# Altium schematic sheet Top.SchDoc
size B; DocumentNumber: 1; SheetNumber: 1; SheetTotal: 3
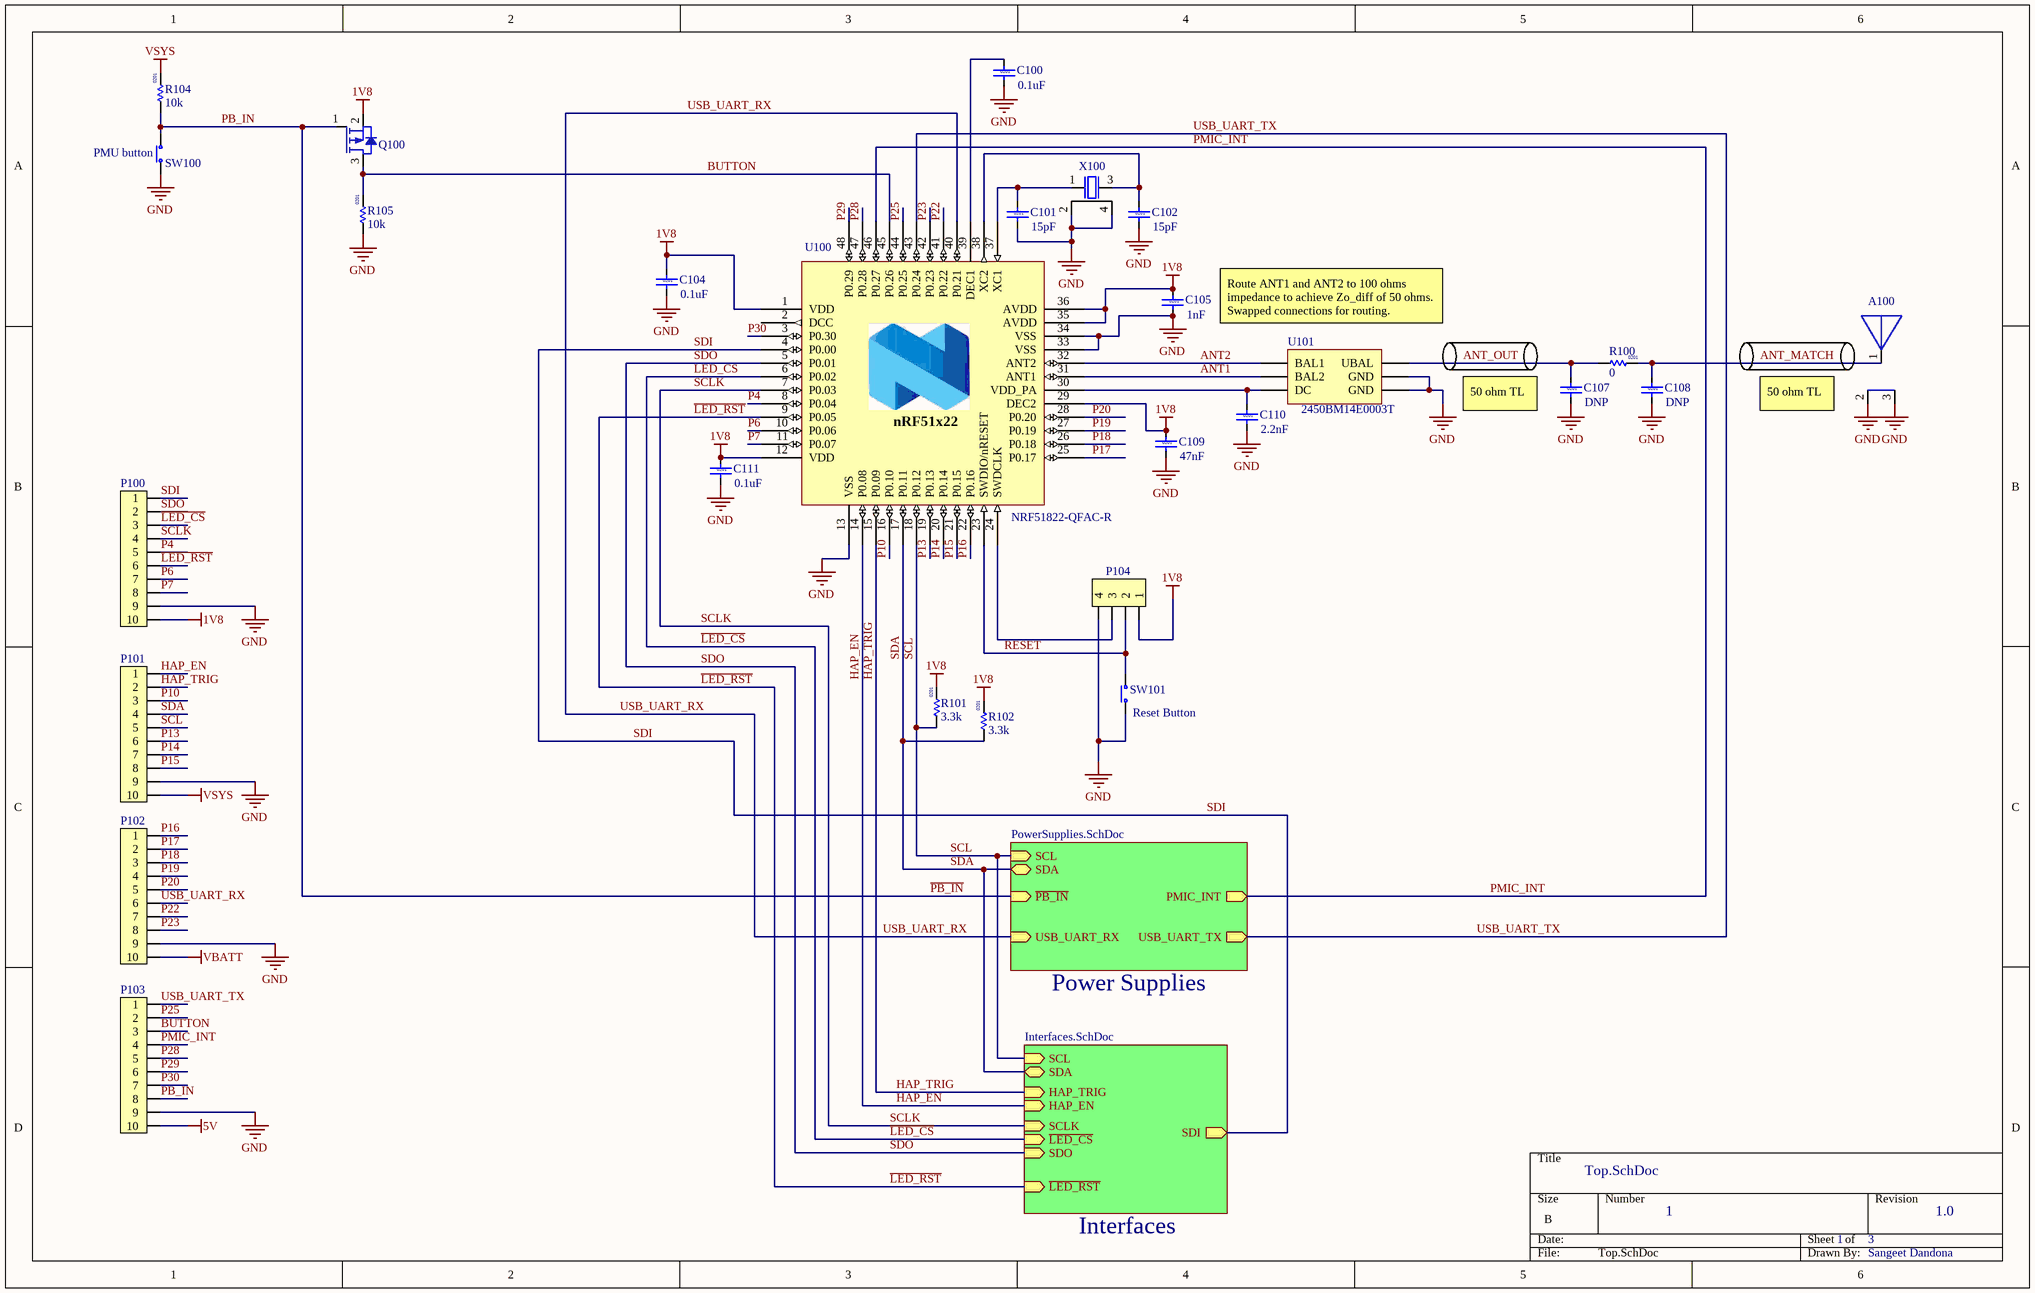
[diagram p0: Top.SchDoc]

## Parts
A100  (no value)  [2450AT07A0100]
C100  value 0.1uF  Size: 0201  [Cap 0201 HD]
C101  value 15pF  Size: 0201  [Cap 0201 HD]
C102  value 15pF  Size: 0201  [Cap 0201 HD]
C104  value 0.1uF  Size: 0201  [Cap 0201 HD]
C105  value 1nF  Size: 0201  [Cap 0201 HD]
C107  value DNP  Size: 0201  [Cap 0201 HD]
C108  value DNP  Size: 0201  [Cap 0201 HD]
C109  value 47nF  Size: 0201  [Cap 0201 HD]
C110  value 2.2nF  Size: 0201  [Cap 0201 HD]
C111  value 0.1uF  Size: 0201  [Cap 0201 HD]
P100  (no value)  [Molex 15-91-2100]
P101  (no value)  [Molex 15-91-2100]
P102  (no value)  [Molex 15-91-2100]
P103  (no value)  [Molex 15-91-2100]
P104  (no value)  [LIST_1x4_SMD]
Q100  (no value)  [SOT-723]
R100  value 0  Size: 0201  [RES 0201 HD]
R101  value 3.3k  Size: 0201  [RES 0201 HD]
R102  value 3.3k  Size: 0201  [RES 0201 HD]
R104  value 10k  Size: 0201  [RES 0201 HD]
R105  value 10k  Size: 0201  [RES 0201 HD]
SW100  (no value)  [ALPS_SKHUxxx010_WO_GND]
SW101  (no value)  [ALPS_SKHUxxx010_WO_GND]
U100  NRF51822-QFAC-R  [QFN40P600X600X90-48N]
U101  MFPN: 2450BM14E0003T  [2450BM14E0003]  (hidden comment: nRF51822 Balun RF filter)
X100  (no value)  [XTAL_ABM11-16]

## Sub-sheets
Interfaces = Interfaces.SchDoc: SDA (bidir), SCL (in), SDO (in), ~{LED_CS} (in), ~{LED_RST} (in), SCLK (in), HAP_EN (in), HAP_TRIG (in), SDI (out)
Power Supplies = PowerSupplies.SchDoc: SCL (in), SDA (bidir), PMIC_INT (out), ~{PB_IN} (in), USB_UART_RX (in), USB_UART_TX (out)

## Nets
1V8: C104.1 C105.1 C109.1 C111.1 P100.10 P104.1 Q100.2(S) R101.2 R102.2 U100.1(VDD) U100.12(VDD) U100.29(DEC2) U100.35(AVDD) U100.36(AVDD)
5V: P103.10
GND: A100.2 A100.3 C100.2 C101.2 C102.2 C104.2 C105.2 C107.2 C108.2 C109.2 C110.2 C111.2 P100.9 P101.9 P102.9 P103.9 P104.4 R105.1 SW100.2(COM) SW101.2(COM) U100.13(VSS) U100.33(VSS) U100.34(VSS) U100.49 U101.2(GND) U101.6(GND) X100.2 X100.4
VBATT: P102.10
VSYS: P101.10 R104.2
~{LED_CS}: P100.3 U100.6(P0.02) ; sheet Interfaces/~{LED_CS}
~{LED_RST}: P100.6 U100.9(P0.05) ; sheet Interfaces/~{LED_RST}
~{PB_IN}: P103.8 Q100.1(G) R104.1 SW100.1(N.O) ; sheet Power Supplies/~{PB_IN}  [also labelled PB_IN]
~{RESET}: P104.2 SW101.1(N.O) U100.23(SWDIO/nRESET)
ANT1: U100.31(ANT1) U101.4(BAL2)
ANT2: U100.32(ANT2) U101.3(BAL1)
ANT_MATCH: A100.1 C108.1 R100.2
ANT_OUT: C107.1 R100.1 U101.1(UBAL)
BUTTON: P103.3 Q100.3(D) R105.2 U100.45(P0.26)
HAP_EN: P101.1 U100.14(P0.08) ; sheet Interfaces/HAP_EN
HAP_TRIG: P101.2 U100.15(P0.09) ; sheet Interfaces/HAP_TRIG
P4: P100.5 U100.8(P0.04)
P6: P100.7 U100.10(P0.06)
P7: P100.8 U100.11(P0.07)
P10: P101.3 U100.16(P0.10)
P13: P101.6 U100.19(P0.13)
P14: P101.7 U100.20(P0.14)
P15: P101.8 U100.21(P0.15)
P16: P102.1 U100.22(P0.16)
P17: P102.2 U100.25(P0.17)
P18: P102.3 U100.26(P0.18)
P19: P102.4 U100.27(P0.19)
P20: P102.5 U100.28(P0.20)
P22: P102.7 U100.41(P0.22)
P23: P102.8 U100.42(P0.23)
P25: P103.2 U100.44(P0.25)
P28: P103.5 U100.47(P0.28)
P29: P103.6 U100.48(P0.29)
P30: P103.7 U100.3(P0.30)
PMIC_INT: P103.4 U100.46(P0.27) ; sheet Power Supplies/PMIC_INT
SCL: P101.5 R101.1 U100.18(P0.12) ; sheet Interfaces/SCL, sheet Power Supplies/SCL
SCLK: P100.4 U100.7(P0.03) ; sheet Interfaces/SCLK
SDA: P101.4 R102.1 U100.17(P0.11) ; sheet Interfaces/SDA, sheet Power Supplies/SDA
SDI: P100.1 U100.4(P0.00) ; sheet Interfaces/SDI
SDO: P100.2 U100.5(P0.01) ; sheet Interfaces/SDO
USB_UART_RX: P102.6 U100.40(P0.21) ; sheet Power Supplies/USB_UART_RX
USB_UART_TX: P103.1 U100.43(P0.24) ; sheet Power Supplies/USB_UART_TX
NetC100_1: C100.1 U100.39(DEC1)
NetC101_1: C101.1 U100.37(XC1) X100.1
NetC102_1: C102.1 U100.38(XC2) X100.3
NetC110_1: C110.1 U100.30(VDD_PA) U101.5(DC)
NetP104_3: P104.3 U100.24(SWDCLK)

Not connected (* = marked no-connect by the designer): U100 2(DCC)

## Notes on the sheet
- (near SW100) PMU button
- Route ANT1 and ANT2 to 100 ohms impedance to achieve Zo_diff of 50 ohms. Swapped connections for routing.
- (near C107) 50 ohm TL
- (near A100) 50 ohm TL
- (near SW101) Reset Button
- 1.0
- Sangeet Dandona
- (in symbol nRF51x22_QFAx) nRF51x22

## Library data of the parts
A100 = 2450AT07A0100: ANTENNA SMD EIA 0402 2.4GHZ; MF: Johanson Technology Inc.; MFPN: 2450AT07A0100E; Size: 1mmx0.5mm; Height: 0.37mm; Cost: 0.36562
C100 C104 C111 = Cap 0201 0.1uF 6.3V: CAP CER 0.1UF 6.3V 10% X5R 0201; MF: Murata Electronics North America; MFPN: GRM033R60J104KE19D; Cost: 0.00780
C101 C102 = Cap 0201 11pF 25V: CAP CER 15PF 25V NP0 0201; MF: Murata Electronics North America; MFPN: GRM0335C1E150FA01D; Cost: 0.00900
C105 = Cap 0201 1nF 25V: CAP CER 1000PF 25V 10% X7R 0201; MF: Murata Electronics North America; MFPN: GRM033R71E102KA01D; Cost: 0.00600
C107 C108 = Cap 0201 Generic: Capacitor, Ceramic 0201, DNP; Cost: 0; MF: N/A; MFPN: DNP
C109 = Cap 0201 47nF 10V: CAP CER 0.047UF 10V 10% X5R 0201; MF: Taiyo Yuden; MFPN: LMK063BJ473KP-F; Cost: 0.03000
C110 = Cap 0201 2.2nF 16V: CAP CER 2200PF 16V 10% X7R 0201; MF: Murata Electronics North America; MFPN: GRM033R71C222KA88D; Cost: 0.00630
P100-P103 = CONN-10: CONN HEADER 10POS .100" VERT TIN; MF: Molex, LLC; MFPN: 0015912100; Cost: 0.47152
P104 = CONN-4: BOARD-BOARD CONNECTOR HEADER, 4WAY, 1ROW; MF: GLOBAL CONNECTOR TECHNOLOGY; MFPN: BG055-04A-1-0450-0530-0350-L-G; Cost: 0.213
Q100 = MOSFET-P: MOSFET P-CH 20V 0.1A VMT3; MF: Rohm Semiconductor; MFPN: RZM001P02T2L; Size: 1.2mm x 0.8mm; Package: SOT-723; Cost: 0.22000; Type: MOSFET-P
R100 = Res 0201 0R Jumper: RES SMD 0.0OHM JUMPER 1/20W 0201; MF: Samsung Electro-Mechanics America, Inc.; MFPN: RC0603J000CS; Cost: 0.00787
R101 R102 = Res 0201 3.3k 5%: RES SMD 3.3K OHM 5% 1/20W 0201; MF: Samsung Electro-Mechanics America, Inc.; MFPN: RC0603J332CS; Cost: 0.00648
R104 R105 = Res 0201 10k 5%: RES SMD 10K OHM 5% 1/20W 0201; MF: Rohm Semiconductor; MFPN: MCR006YRTJ103; Cost: 0.00828
SW100 SW101 = SW-PB: Tactile Switches 6.0x6.0x2.5mm 160gf; MF: ALPS; MFPN: SKHUALE010; Cost: 0.201; Size: 6.3mm x 6.2mm x 3.1mm
U100 = nRF51x22_QFAx: IC SOC 2.4GHZ 256K FLASH 48QFN; MF: Nordic Semiconductor ASA; Cost: 2.33310; MFPN: NRF51822-QFAC-R
U101 = nRF51822 Balun RF filter: NORDIC NRF51 BALUN FILTER; MF: Johanson Technology Inc.; Cost: 0.66000
X100 = XTAL_ABM11-16: CRYSTAL 16.0000MHZ 10PF SMD; MF: Abracon LLC; MFPN: ABM11-16.000MHZ-B7G-T; Size: 2.0mm x 1.6mm; Cost: 0.60000